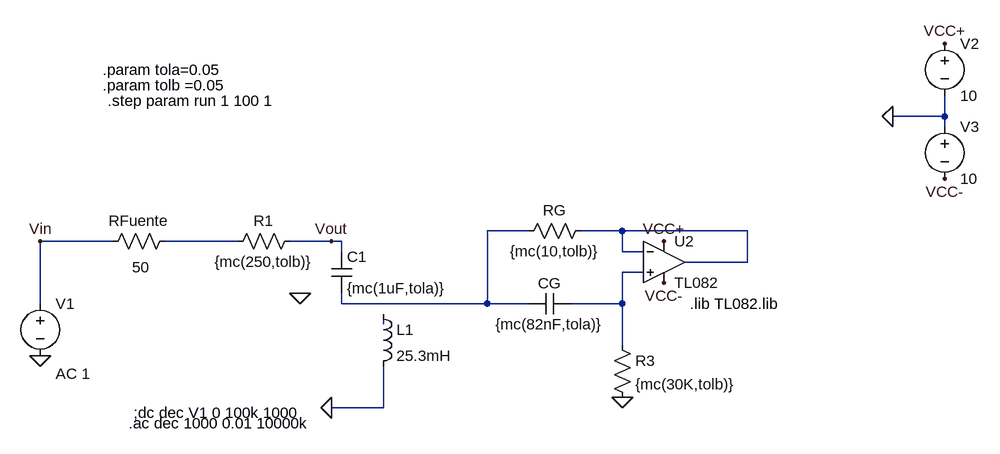
[diagram p0: schematic BR.asc]
BR.asc, the LTspice schematic file:
Version 4
SHEET 1 1256 680
WIRE 1200 -128 1200 -160
WIRE 1200 -128 1120 -128
WIRE 1200 -112 1200 -128
WIRE 560 48 496 48
WIRE 704 48 640 48
WIRE 896 48 704 48
WIRE -80 64 -192 64
WIRE 112 64 0 64
WIRE 256 64 192 64
WIRE 272 64 256 64
WIRE 272 80 272 64
WIRE 704 80 704 48
WIRE 736 80 704 80
WIRE 896 96 896 48
WIRE 896 96 800 96
WIRE 736 112 704 112
WIRE -192 160 -192 64
WIRE 272 160 272 144
WIRE 496 160 496 48
WIRE 496 160 272 160
WIRE 560 160 496 160
WIRE 704 160 704 112
WIRE 704 160 624 160
WIRE 336 192 336 176
WIRE 704 224 704 160
WIRE 336 320 336 256
WIRE 336 320 256 320
FLAG 256 320 0
FLAG 704 304 0
FLAG 768 64 VCC+
FLAG 768 128 VCC-
FLAG 1120 -128 0
FLAG 1200 -240 VCC+
FLAG 1200 -32 VCC-
FLAG -192 64 Vin
FLAG 256 64 Vout
FLAG 208 144 0
FLAG -192 240 0
SYMBOL voltage -192 144 R0
WINDOW 123 24 124 Left 2
WINDOW 39 0 0 Left 2
SYMATTR Value2 AC 1
SYMATTR InstName V1
SYMATTR Value ""
SYMBOL cap 256 80 R0
SYMATTR InstName C1
SYMATTR Value {mc(1uF,tola)}
SYMBOL res 208 48 R90
WINDOW 0 0 56 VBottom 2
WINDOW 3 32 56 VTop 2
SYMATTR InstName R1
SYMATTR Value {mc(250,tolb)}
SYMBOL res 656 32 R90
WINDOW 0 0 56 VBottom 2
WINDOW 3 32 56 VTop 2
SYMATTR InstName RG
SYMATTR Value {mc(10,tolb)}
SYMBOL cap 624 144 R90
WINDOW 0 0 32 VBottom 2
WINDOW 3 32 32 VTop 2
SYMATTR InstName CG
SYMATTR Value {mc(82nF,tola)}
SYMBOL res 688 208 R0
SYMATTR InstName R3
SYMATTR Value {mc(30K,tolb)}
SYMBOL Opamps\\opamp2 768 32 R0
SYMATTR InstName U2
SYMATTR Value TL082
SYMBOL voltage 1200 -256 R0
SYMATTR InstName V2
SYMATTR Value 10
SYMBOL voltage 1200 -128 R0
SYMATTR InstName V3
SYMATTR Value 10
SYMBOL res 16 48 R90
WINDOW 0 0 56 VBottom 2
WINDOW 3 40 53 VTop 2
SYMATTR InstName RFuente
SYMATTR Value 50
SYMBOL ind 320 160 R0
SYMATTR InstName L1
SYMATTR Value 25.3mH
TEXT -48 328 Left 2 !;dc dec V1 0 100k 1000
TEXT -56 344 Left 2 !.ac dec 1000 0.01 10000k
TEXT 808 160 Left 2 !.lib TL082.lib
TEXT -96 -200 Left 2 !.param tola=0.05
TEXT -96 -176 Left 2 !.param tolb =0.05
TEXT -88 -152 Left 2 !.step param run 1 100 1

The netlist it stands for:
* BR.asc
V1 Vin 0 AC 1
C1 Vout N001 {mc(1uF,tola)}
R1 Vout N003 {mc(250,tolb)}
RG N002 N001 {mc(10,tolb)}
CG N004 N001 {mc(82nF,tola)}
R3 N004 0 {mc(30K,tolb)}
XU2 N004 N002 VCC+ VCC- N002 TL082  ; pins In+ In- V+ V- OUT
V2 VCC+ 0 10
V3 0 VCC- 10
RFuente N003 Vin 50
L1 N005 0 25.3mH
;dc dec V1 0 100k 1000
.ac dec 1000 0.01 10000k
.lib TL082.lib
.param tola=0.05
.param tolb =0.05
.step param run 1 100 1
.backanno
.end